# Altium schematic sheet OurEDA-P1K_sensor.SchDoc
size A4; SheetNumber: 4; SheetTotal: 7
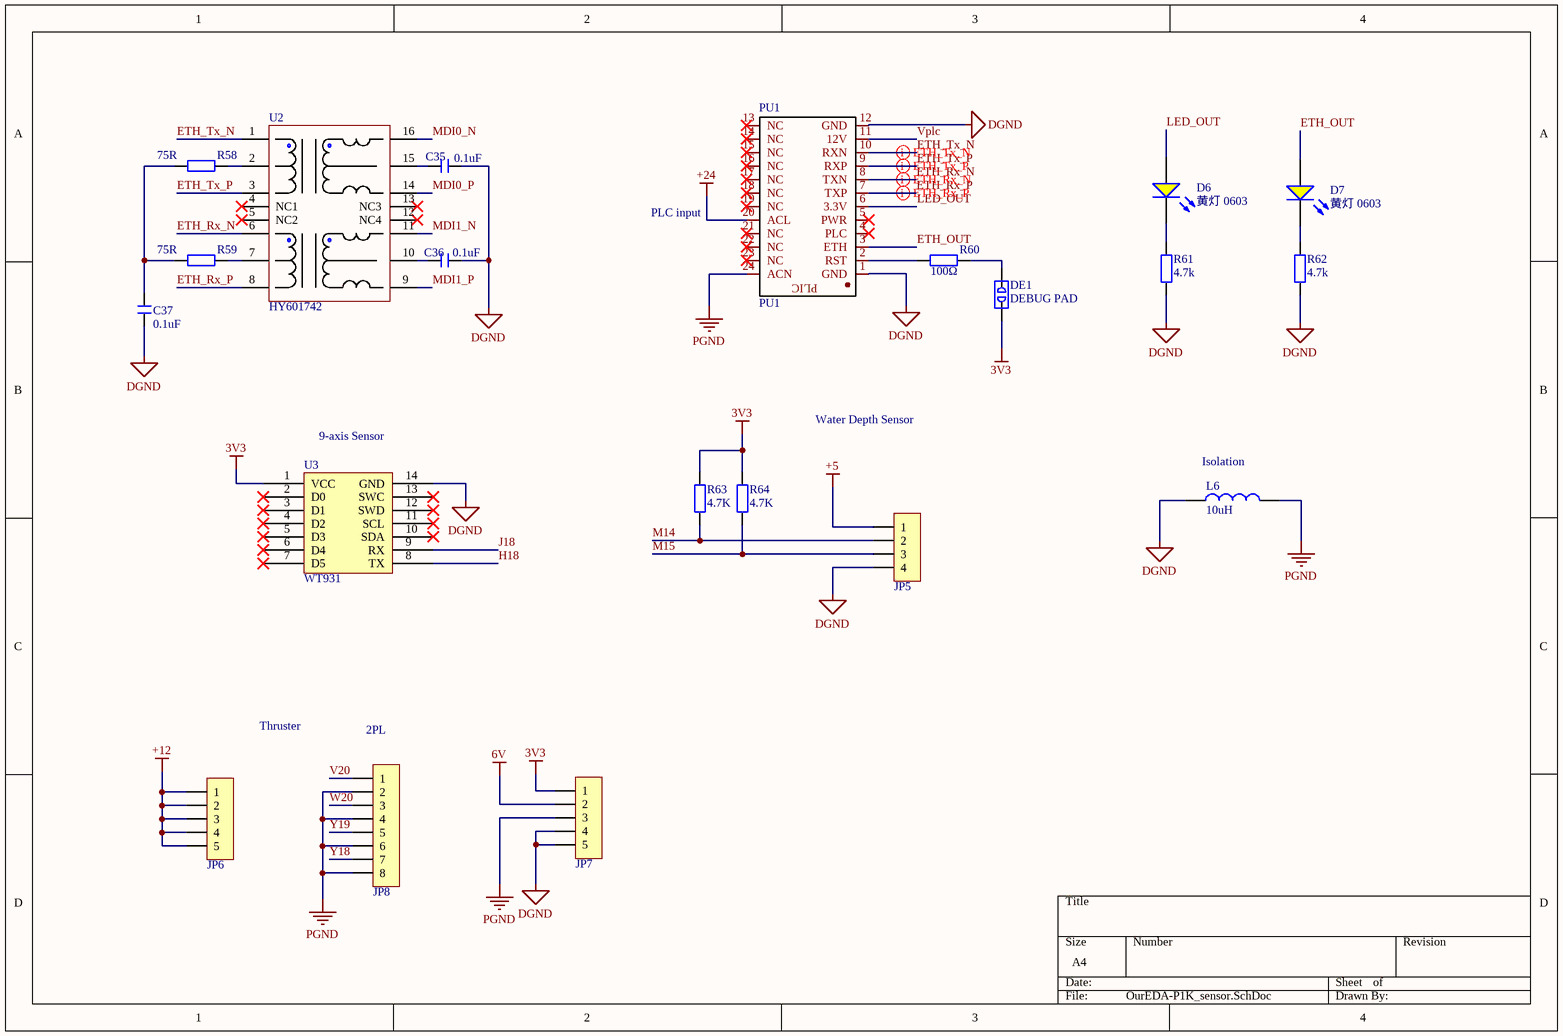
[diagram p0: OurEDA-P1K_sensor.SchDoc]

## Parts
C35  0.1uF  [C 0603_L]
C36  0.1uF  [C 0603_L]
C37  0.1uF  [C 0603_L]
D6  黄灯 0603  [0603_LED_S1]
D7  黄灯 0603  [0603_LED_S1]
DE1  DEBUG PAD  [DEBUG_A]
JP5  HDR-1X4  [MX 1.25-LI-4P]  (value not drawn)
JP6  HDR-1X5  [KF128-5.08-5P]  (value not drawn)
JP7  HDR-1X5  [KF128-5.08-5P]  (value not drawn)
JP8  HDR-1X8  [KF128-5.08-8P]  (value not drawn)
L6  10uH  [L 0805]
PU1  PU1  [LW-MPA223A]
R58  75R  [0603_R]
R59  75R  [0603_R]
R60  100Ω  [0603_R]
R61  4.7k  [R 0603_L]
R62  4.7k  [R 0603_L]
R63  4.7K  [R 0603_L]
R64  4.7K  [R 0603_L]
U2  HY601742  [SOP-16_350mil]
U3  WT931  [WT931]

## Nets
3V3: DE1.1 JP7.1 R63.2 R64.2 U3.1(VCC)
6V: JP7.2
+5: JP5.1
+12: JP6.1 JP6.2 JP6.3 JP6.4 JP6.5
+24: PU1.20(ACL)
DGND: C35.1 C36.1 C37.1 JP5.4 JP7.4 JP7.5 L6.1 PU1.1(GND) PU1.12(GND) R61.1 R62.1 U3.14(GND)
PGND: JP7.3 JP8.2 JP8.4 JP8.6 JP8.8 L6.2 PU1.24(ACN)
ETH_OUT: D7.A PU1.3(ETH)
ETH_Rx_N: PU1.8(TXN) U2.6(RD+)
ETH_Rx_P: PU1.7(TXP) U2.8(RD-)
ETH_Tx_N: PU1.10(RXN) U2.1(TD+)
ETH_Tx_P: PU1.9(RXP) U2.3(TD-)
H18: U3.8(TX)
J18: U3.9(RX)
LED_OUT: D6.A PU1.6(3.3V)
M14: JP5.2 R63.1
M15: JP5.3 R64.1
MDI0_N: U2.16(TX+)
MDI0_P: U2.14(TX-)
MDI1_N: U2.11(RX+)
MDI1_P: U2.9(RX-)
V20: JP8.1
Vplc: PU1.11(12V)
W20: JP8.3
Y18: JP8.7
Y19: JP8.5
NetC35_2: C35.2 U2.15(CM1)
NetC36_2: C36.2 U2.10(CM2)
NetC37_2: C37.2 R58.2 R59.2
NetD6_K: D6.K R61.2
NetD7_K: D7.K R62.2
NetDE1_2: DE1.2 R60.1
NetPU1_2: PU1.2(RST) R60.2
NetR58_1: R58.1 U2.2(CT1)
NetR59_1: R59.1 U2.7(CT2)

Not connected (* = marked no-connect by the designer): PU1 4(PLC)* 5(PWR)* 13(NC)* 14(NC)* 15(NC)* 16(NC)* 17(NC)* 18(NC)* 19(NC)* 21(NC)* 22(NC)* 23(NC)*; U2 4(NC1)* 5(NC2)* 12(NC4)* 13(NC3)*; U3 2(D0)* 3(D1)* 4(D2)* 5(D3)* 6(D4)* 7(D5)* 10(SDA)* 11(SCL)* 12(SWD)* 13(SWC)*

## Layout directives
differential pair: ETH_Rx_N, ETH_Rx_P, ETH_Tx_N, ETH_Tx_P

## Notes on the sheet
- PLC input
- (near U3) 9-axis Sensor
- Water Depth Sensor
- (near L6) Isolation
- Thruster
- (near JP8) 2PL
- (in symbol LW-MPA223A) PLIC

## Library data of the parts
C35-C37 = C: 无极性贴片电容; 版权归属: 源创客; BOM名称: 无极性贴片电容; 学习资源: www.ooocke.com
D6 D7 = 0603 黄灯: 发光二极管; ComponentLink1Description: 供应商链接; ComponentLink1URL: http://www.szlcsc.com/product/details_73147.html; Package: 0603; Supplier: LC; SuppliersPartNumber: C72038
DE1 = DEBUG: 调试断点焊盘; 版权归属: 源创客; BOM名称: 调试断点焊盘; 学习资源: www.ooocke.com
JP5 = Header 4: 4P接插件; 版权归属: 源创客; BOM名称: 4P接插件; 学习资源: www.ooocke.com
JP6 JP7 = Header 5: 5P接插件; 版权归属: 源创客; BOM名称: 5P接插件; 学习资源: www.ooocke.com
JP8 = Header 8: 8P接插件; 版权归属: 源创客; BOM名称: 8P接插件; 学习资源: www.ooocke.com
L6 = L: 小功率贴片电感; 版权归属: 源创客; BOM名称: 小功率贴片电感; 学习资源: www.ooocke.com
PU1 = LW-MPA223A
R58-R60 = 0603 330Ω (3300) 1%: 贴片电阻; ComponentLink1Description: 供应商链接; ComponentLink1URL: http://www.szlcsc.com/product/details_23865.html; Package: 0603; Supplier: LC; SuppliersPartNumber: C23138
R61-R64 = R: 贴片电阻; 版权归属: 源创客; BOM名称: 贴片电阻; 学习资源: www.ooocke.com
U2 = HY601742_1: 以太网变压器
U3 = WT931: 维特智能WT931九轴模块